# EasyEDA Pro project MAINBOARD.epro

# Schematic Schematic1
Board Name: Board1; Create Date: 2024-12-09; Page Name: P1; Project Name: 圈圈机分电板结构; Schematic Name: Schematic1; Update Date: 2025-01-17; Company: WAKKK; Drawed: WAKKK; Page Size: A4; Version: V1.0
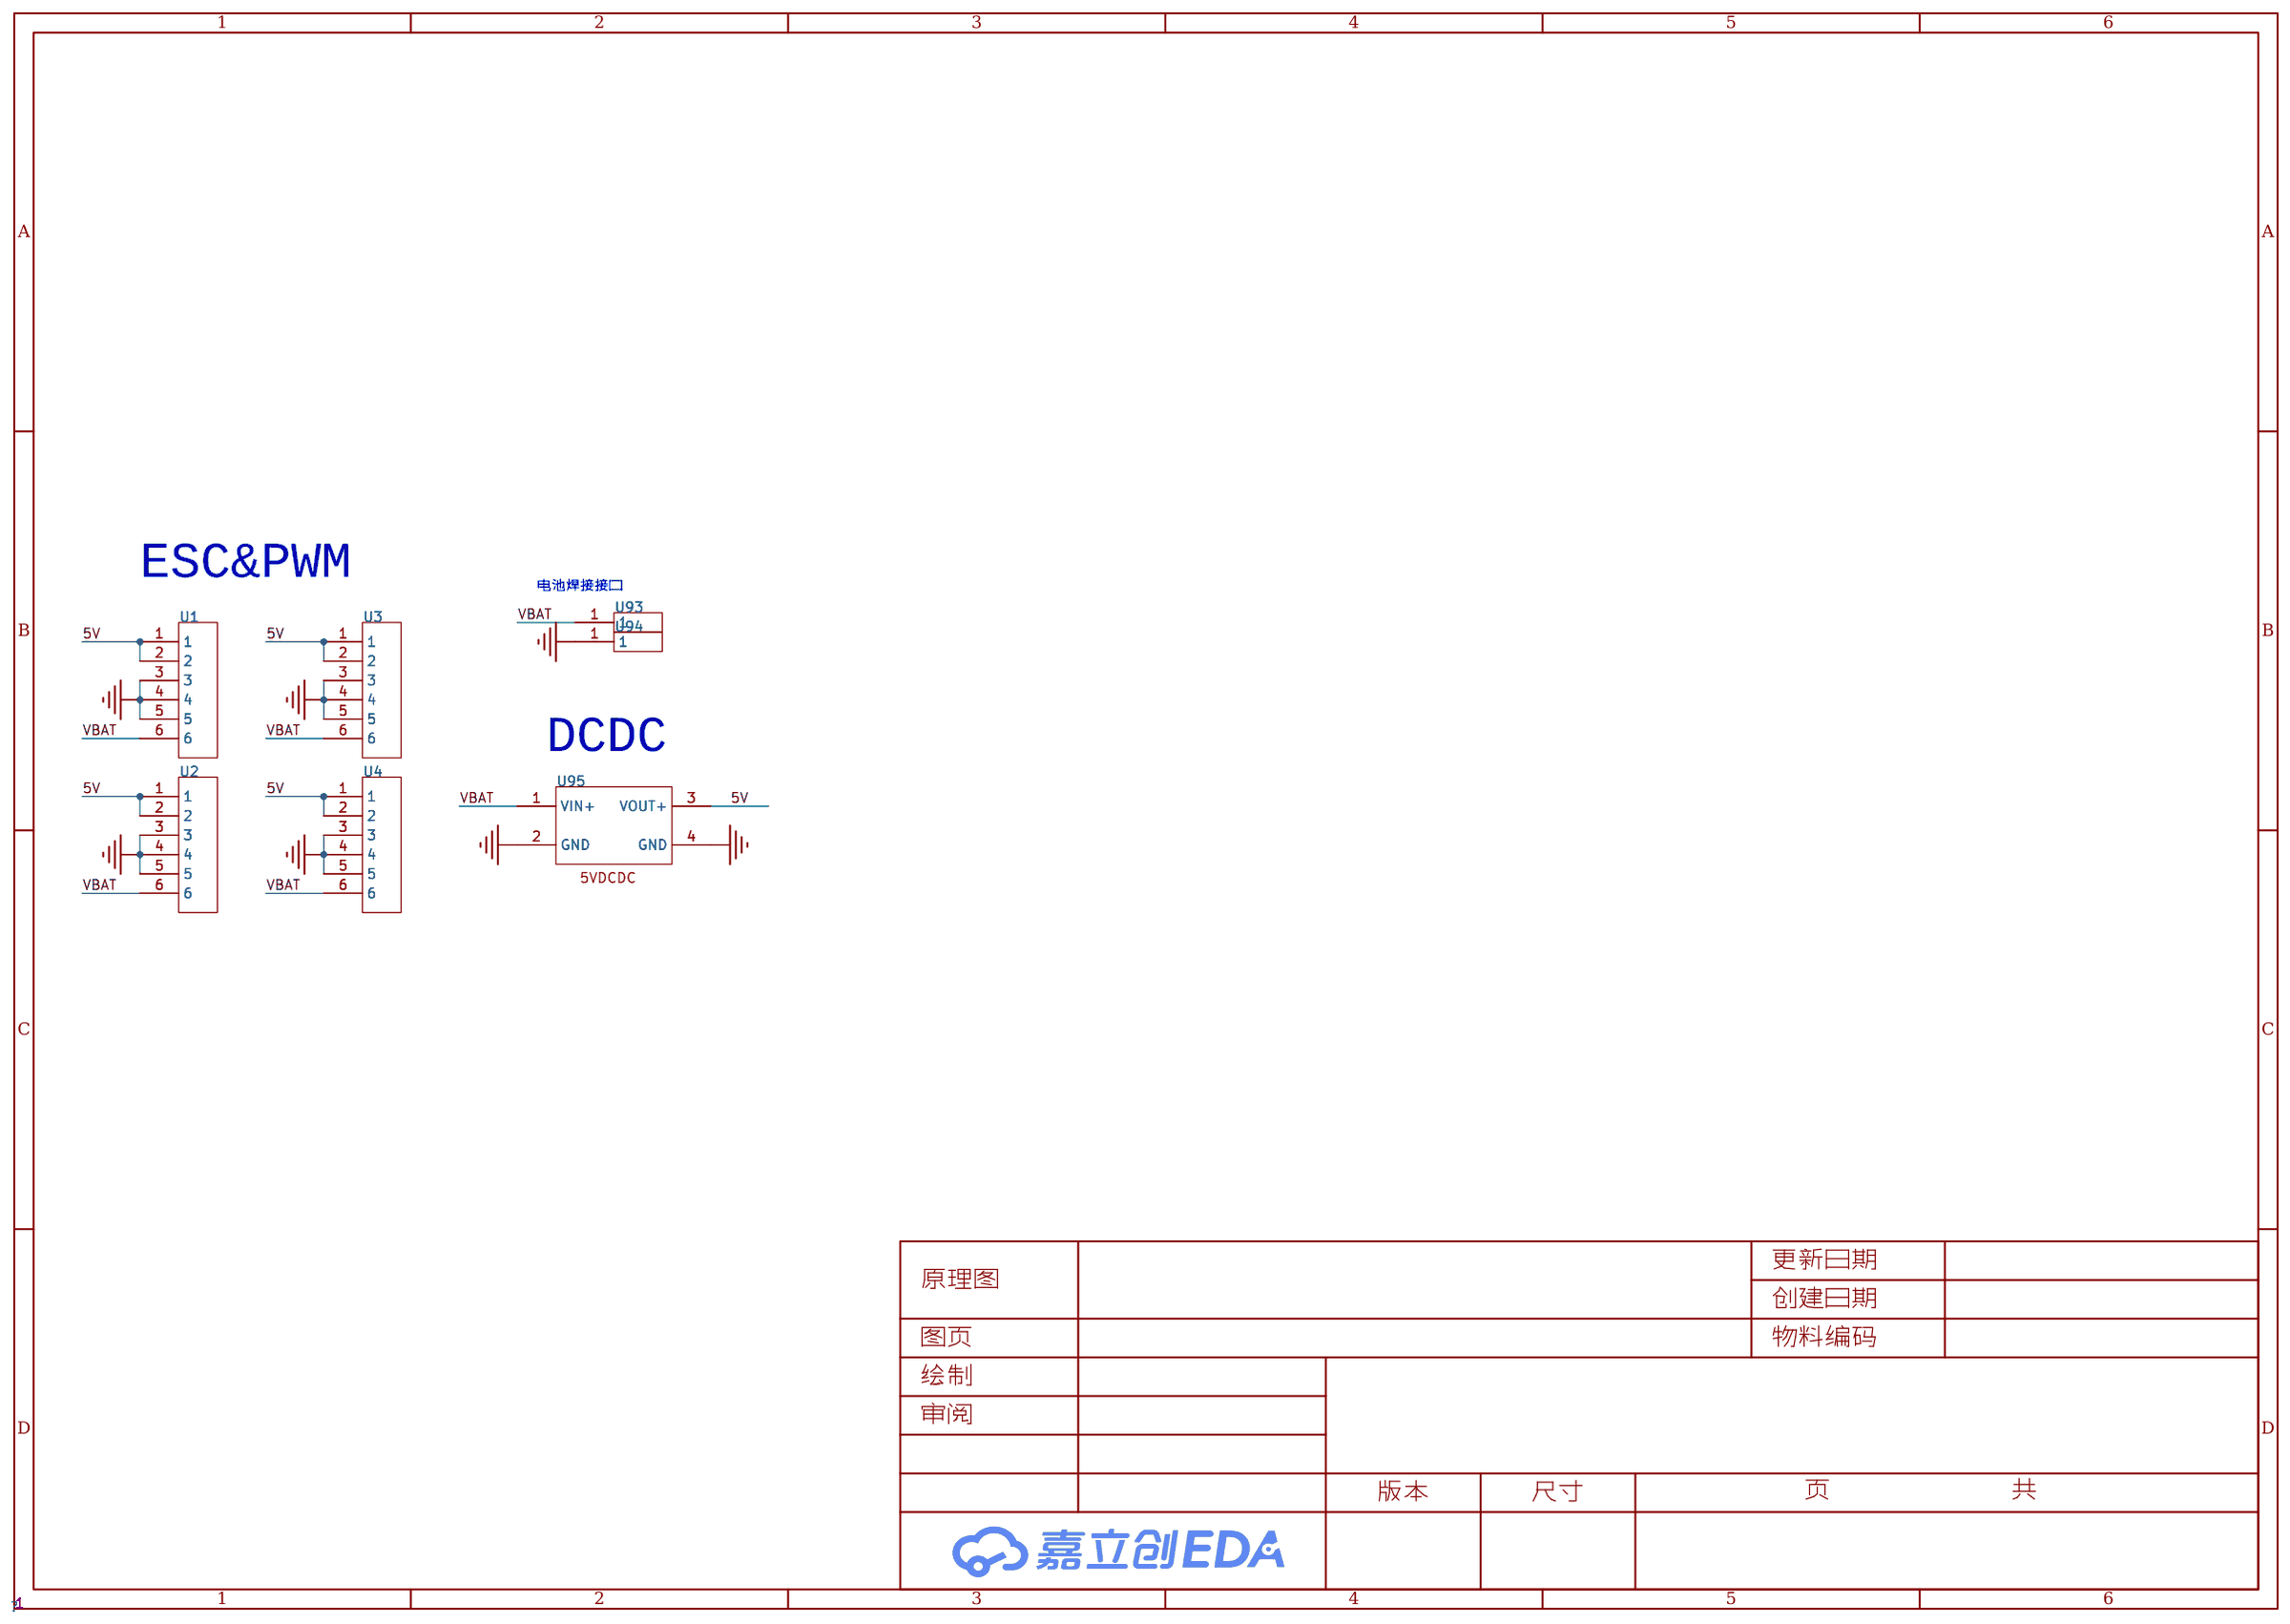
[diagram p0: schematic sheet]

## Parts
U1  -  [6pin焊接引出]
U2  -  [6pin焊接引出]
U3  -  [6pin焊接引出]
U4  -  [6pin焊接引出]
U93  -  [表面焊盘]
U94  -  [表面焊盘]
U95  -  [DCDC5V不带直插排针焊盘]

## Library data of the parts
U1-U4 = 6pin焊接引出: Check: false
U93 U94 = 表面焊盘: Check: false
U95 = DCDC-5V: 蓝色DCDC降压模块（贴片）; Check: false

## Nets
5V: U1.1 U1.2 U2.1 U2.2 U3.1 U3.2 U4.1 U4.2 U95.3(VOUT+)
GND: U1.3 U1.4 U1.5 U2.3 U2.4 U2.5 U3.3 U3.4 U3.5 U4.3 U4.4 U4.5 U94.1 U95.2(GND) U95.4(GND)
VBAT: U1.6 U2.6 U3.6 U4.6 U93.1 U95.1(VIN+)

## Notes on the sheet
- ESC&PWM
- 电池焊接接口
- DCDC

# Board PCB1
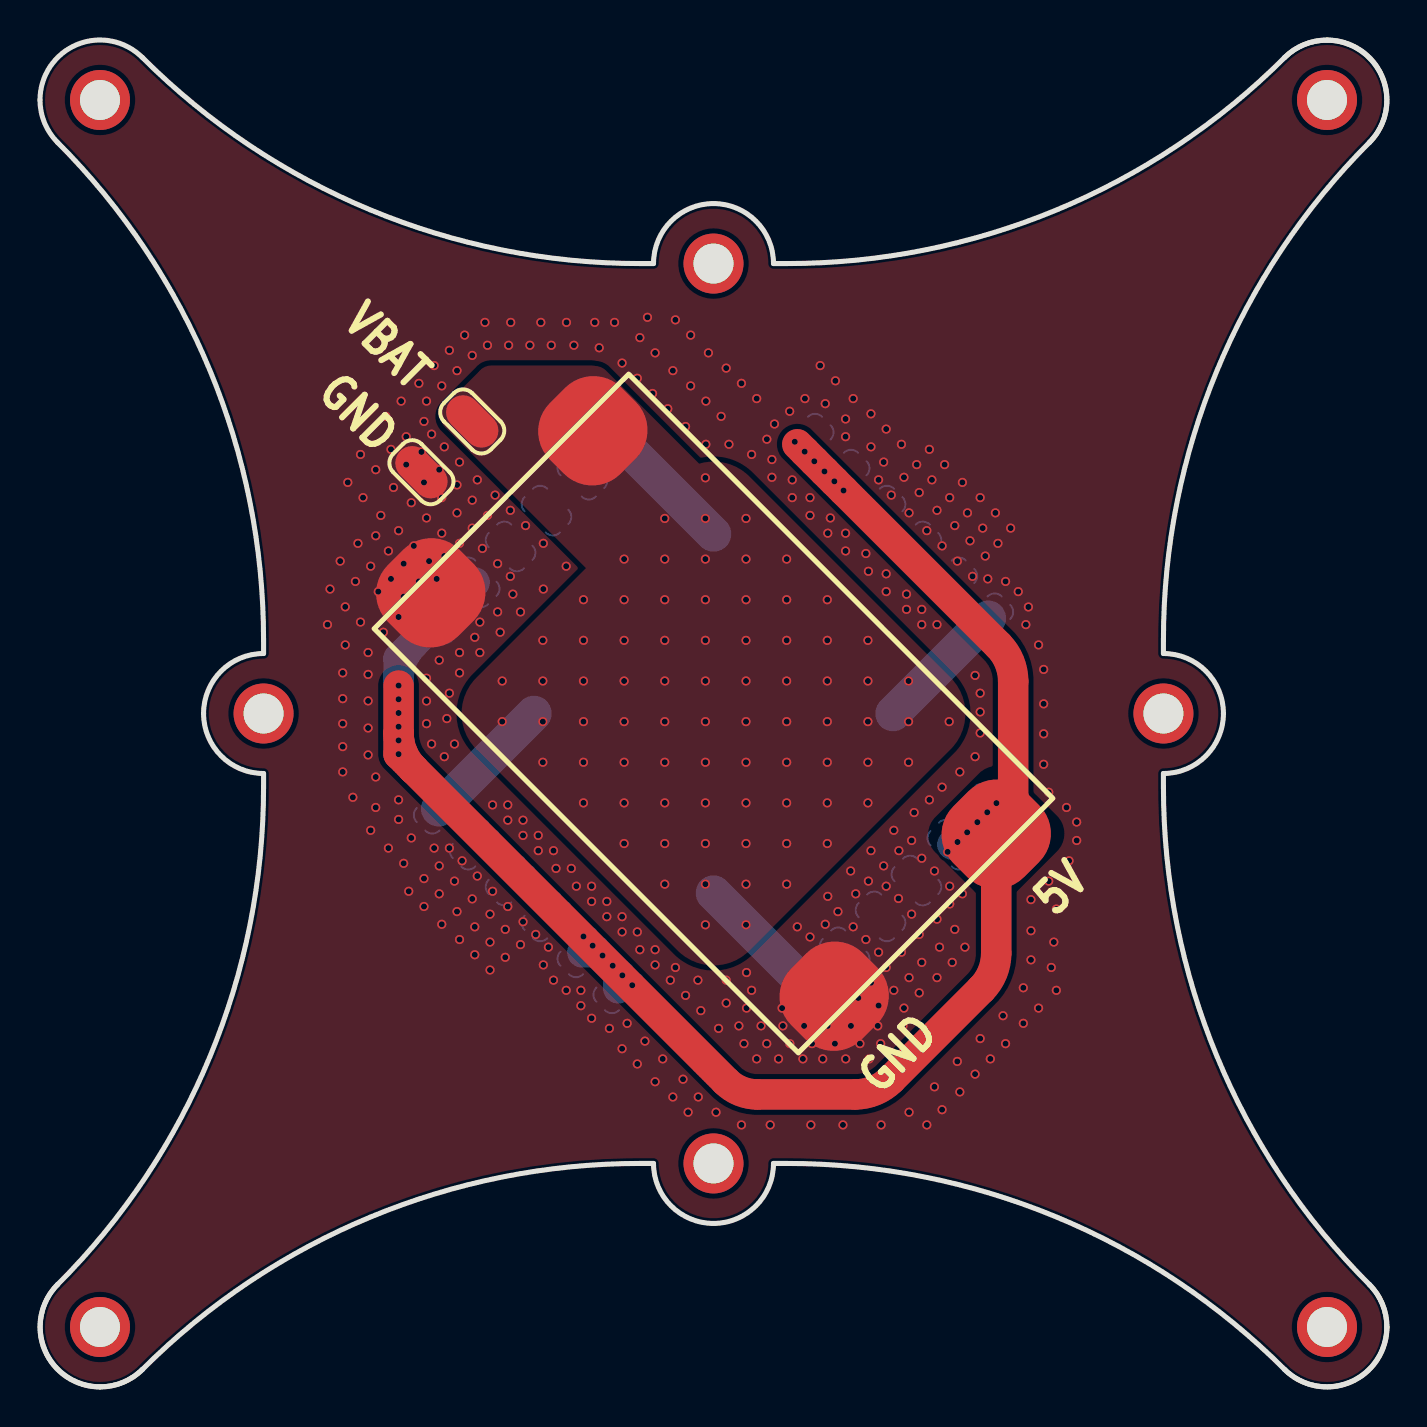
[diagram p1: board, top side]
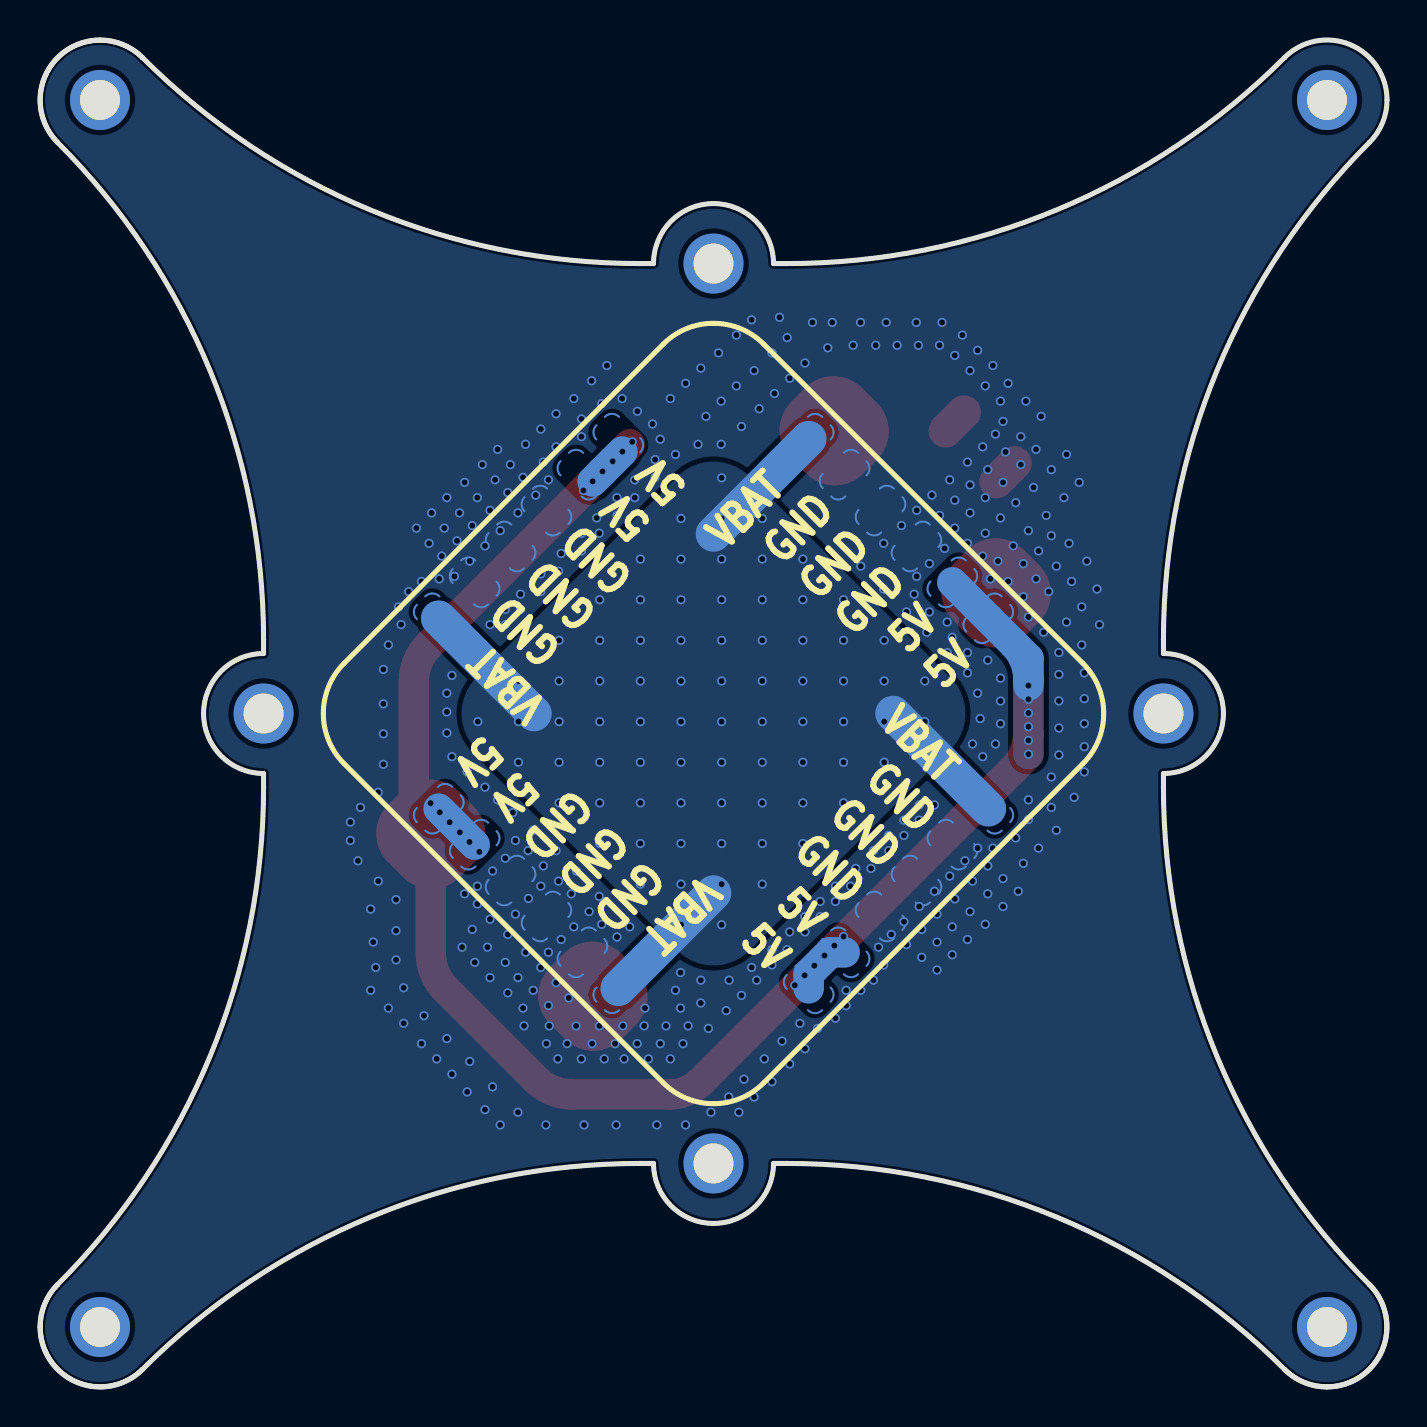
[diagram p2: board, bottom side, seen from below]

Outline 67.36 x 67.36 mm; copper layers: Top Layer, Bottom Layer. Coordinates in mm from the lower left corner of the outline.
Outline path: 0.88,5.12 arc(0.23,1.85) 3,0 arc(4.15,0.23) 5.12,0.88 ; 0.88,5.12 arc(0.88,0.88) 5.12,0.88 ; 0.88,5.12 arc(8.5,16.53) 11.18,29.99 11.18,30.68 arc(9.06,31.56) 8.18,33.68 arc(9.06,35.8) 11.18,36.68 11.18,37.37 arc(8.5,50.83) 0.88,62.24 arc(0.23,63.21) 0,64.36 arc(1.85,67.13) 5.12,66.48 arc(16.53,58.86) 29.99,56.18 30.68,56.18 arc(33.68,59.18) 36.68,56.18 37.37,56.18 arc(50.83,58.86) 62.24,66.48 ; 5.12,0.88 arc(16.53,8.5) 29.99,11.18 30.68,11.18 arc(33.68,8.18) 36.68,11.18 37.37,11.18 arc(50.83,8.5) 62.24,0.88 ; 62.24,0.88 arc(66.48,0.88) 66.48,5.12 ; 62.24,0.88 arc(65.51,0.23) 67.36,3 arc(67.13,4.15) 66.48,5.12 ; 66.48,62.24 arc(58.86,50.83) 56.18,37.37 56.18,36.68 arc(58.3,35.8) 59.18,33.68 arc(58.3,31.56) 56.18,30.68 56.18,29.99 arc(58.86,16.53) 66.48,5.12 ; 66.48,62.24 arc(66.48,66.48) 62.24,66.48 ; 66.48,62.24 arc(67.13,65.51) 64.36,67.36 arc(63.21,67.13) 62.24,66.48
Stack: Top Layer 0.035mm / Dielectric1 1.51mm FR4 er 4.5 / Bottom Layer 0.035mm

## Design rules (mm)
template: 自定义配置
spacing copperThickness1oz (default): track to track 0.102, other pairs 0.152 to 0.3
spacing copperThickness2oz: track to track 0.203, other pairs 0.152 to 0.3
track width copperThickness1oz (default): min 0.127, default 0.254, max 2.54
track width copperThickness2oz: min 0.203, default 0.254, max 2.54
differential pair differentialPair (default): width min 0.127, default 0.254, max 2.54; gap min 0.152, default 0.152
via viaSize (default): diameter min 0.254, default 0.457, max 10; hole min 0.3, default 0.305, max 6.299

## Placement (name value [footprint] x y rotation side)
NOREF  -  [Pad_e9]  33.68 56.18 0 top
NOREF#2  -  [Pad_e13]  33.68 11.18 0 top
NOREF#3  -  [Pad_e12]  11.18 33.68 0 top
NOREF#4  -  [Pad_e14]  3 64.36 0 top
NOREF#5  -  [Pad_e17]  3 3 0 top
NOREF#6  -  [Pad_e11]  56.18 33.68 0 top
NOREF#7  -  [Pad_e16]  64.36 3 0 top
NOREF#8  -  [Pad_e15]  64.36 64.36 0 top
U1  -  [6pin焊接引出]  24.43 42.93 135 bottom
U2  -  [6pin焊接引出]  24.43 24.43 225 bottom
U3  -  [6pin焊接引出]  42.93 24.43 315 bottom
U4  -  [6pin焊接引出]  42.93 42.93 45 bottom
U93  -  [表面焊盘]  21.62 48.29 315 top
U94  -  [表面焊盘]  19.08 45.75 315 top
U95  -  [DCDC5V不带直插排针焊盘]  33.68 33.68 315 top

## Footprints (pads in the part's own frame, mm; a bottom-side part is the same pattern mirrored in y, then rotated)
6pin焊接引出
  custom 2.5x1.6 smd: 1(0,-6.35) 2(0,-3.81) 3(0,-1.27) 4(0,1.27) 5(0,3.81) 6(0,6.35)
DCDC5V不带直插排针焊盘
  rrect 5x5.08 smd: 1(-14.264,5.73) 2(-14.264,-5.73) 3(14.264,5.73) 4(14.264,-5.73)
Pad_e9
  round 3 hole 2: 1(0,0)
Pad_e11
  round 3 hole 2: 1(0,0)
Pad_e12
  round 3 hole 2: 1(0,0)
Pad_e13
  round 3 hole 2: 1(0,0)
Pad_e14
  round 3 hole 2: 1(0,0)
Pad_e15
  round 3 hole 2: 1(0,0)
Pad_e16
  round 3 hole 2: 1(0,0)
Pad_e17
  round 3 hole 2: 1(0,0)
表面焊盘
  rrect 3x1.7 smd: 1(0,0)

## Nets
As in the schematic.

Pads without a net: NOREF 1; NOREF#2 1; NOREF#3 1; NOREF#4 1; NOREF#5 1; NOREF#6 1; NOREF#7 1; NOREF#8 1

## Via types
v1: diameter 0.457, hole 0.305, Top Layer to Bottom Layer, 491 vias

## Routing (per net, layer and track width the routed paths; a pad name or vN(x,y) marks a point on that pad's centre or on a via; arc(x,y) is an arc through that point)
5V: length 92
  Top Layer w1.524: 17.93,32.7 v1(17.93,31.65) 18.68,30.9 ; 17.93,32.7 v1(17.93,35.08) ; 17.93,32.7 arc(17.94,32.52) 17.96,32.34 arc(18.02,32.03) 18.13,31.73 arc(18.36,31.29) 18.68,30.9 ; 37.87,47.14 v1(38.24,46.78) v1(38.72,46.29) v1(39.23,45.78) v1(39.72,45.29) v1(40.18,44.83) 47.92,37.09 arc(48.47,36.27) 48.67,35.3 48.67,29.55 arc(48.47,28.57) 47.92,27.75 U95.3 47.82,21.69 arc(47.62,20.72) 47.07,19.9 42.55,15.37 arc(41.73,14.82) 40.76,14.63 35.88,14.63 arc(35.02,14.8) 34.3,15.28 18.68,30.9
  Bottom Layer w1.524: U3.2 U3.1 ; v1(38.24,46.78) v1(38.72,46.29) v1(39.23,45.78) v1(39.72,45.29) ; v1(17.93,35.08) 17.93,35.38 ; 17.93,35.38 17.93,36.43 18.68,37.18 ; 17.93,35.38 arc(18.13,36.35) 18.68,37.18 ; U2.1 28.92,20.66 27.85,21.74 U2.2 ; 18.68,37.18 U1.1 U1.2
  vias: v1(17.93,34.39) v1(17.93,33.71) v1(17.93,33.02) v1(17.93,32.33) v1(27.18,22.53) v1(27.64,22.07) v1(28.13,21.58) v1(28.64,21.07) v1(29.12,20.58) v1(29.62,20.09) v1(37.74,47.27) v1(45.39,26.76) v1(45.88,27.25) v1(46.37,27.74) v1(46.87,28.25) v1(47.37,28.74) v1(47.83,29.2)
GND:
  vias: v1(14.38,38.12) v1(14.5,39.9) v1(15.01,41.3) v1(15.14,35.71) v1(15.14,34.42) v1(15.14,33.17) v1(15.14,32.02) v1(15.14,30.76) v1(15.27,39.01) v1(15.27,37.11) v1(15.39,45.24) v1(15.65,29.49) v1(15.77,40.28) v1(15.9,42.19) v1(16.03,46.63) v1(16.03,38.25) v1(16.15,44.48) v1(16.41,36.73) v1(16.41,35.63) v1(16.41,34.31) v1(16.41,32.96) v1(16.41,31.61) v1(16.53,41.05) v1(16.53,27.84) v1(16.79,45.87) v1(16.79,42.57) v1(16.79,30.51) v1(16.79,28.98) v1(16.92,39.78) v1(17.04,43.59) v1(17.17,37.74) v1(17.3,48.54) v1(17.42,41.81) v1(17.42,26.95) v1(17.55,46.89) v1(17.55,40.41) v1(17.68,44.98) v1(17.93,42.82) v1(17.93,38.51) v1(17.93,29.36) v1(17.93,28.38) v1(18.06,49.3) v1(18.19,41.17) v1(18.19,39.52) v1(18.19,26.19) v1(18.31,47.52) v1(18.31,46.13) v1(18.44,24.79) v1(18.57,44.22) v1(18.57,27.46) v1(18.69,42.06) v1(18.95,50.19) v1(18.95,40.28) v1(19.08,46.76) v1(19.2,48.29) v1(19.2,45.24) v1(19.2,25.43) v1(19.2,24.03) v1(19.33,49.3) v1(19.33,43.46) v1(19.33,35.45) v1(19.33,34.3) v1(19.33,33.17) v1(19.46,41.3) v1(19.58,47.65) v1(19.58,32.16) v1(19.71,51.08) v1(19.71,26.95) v1(19.84,40.41) v1(19.96,45.87) v1(19.96,36.35) v1(19.96,26.06) v1(19.96,24.66) v1(20.09,50.06) v1(20.09,44.48) v1(20.09,42.7) v1(20.09,23.14) v1(20.22,47.02) v1(20.22,41.55) v1(20.22,31.52) v1(20.34,33.43) v1(20.47,51.84) v1(20.47,34.7) v1(20.47,26.95) v1(20.73,32.16) v1(20.73,25.3) v1(20.85,50.83) v1(20.85,45.11) v1(20.85,43.71) v1(20.85,23.77) v1(20.98,46.25) v1(20.98,42.19) v1(20.98,36.73) v1(20.98,35.71) v1(20.98,22.38) v1(21.11,26.31) v1(21.23,52.6) v1(21.62,51.59) v1(21.62,44.35) v1(21.62,42.95) v1(21.62,24.41) v1(21.74,37.49) v1(21.74,23.01) v1(21.74,21.62) v1(21.87,45.36) v1(21.87,25.55) v1(22,38.25) v1(22,36.73) v1(22.12,41.94) v1(22.25,53.24) v1(22.38,52.1) v1(22.38,43.59) v1(22.5,23.65) v1(22.5,22.25) v1(22.5,20.85) v1(22.63,29.11) v1(22.63,24.79) v1(22.76,44.6) v1(22.89,41.17) v1(22.89,38.76) v1(23.01,37.74) v1(23.27,22.89) v1(23.27,21.49) v1(23.39,29.11) v1(23.39,28.35) v1(23.39,24.03) v1(23.44,52.1) v1(23.52,43.84) v1(23.52,40.54) v1(23.54,53.24) v1(23.65,39.65) v1(24.03,38.76) v1(24.03,22.12) v1(24.16,28.35) v1(24.16,27.58) v1(24.16,23.27) v1(24.28,43.08) v1(24.5,52.1) v1(24.79,22.63) v1(24.92,27.58) v1(24.92,26.82) v1(25.04,53.24) v1(25.17,42.19) v1(25.17,39.9) v1(25.17,21.11) v1(25.43,22) v1(25.57,52.1) v1(25.68,26.82) v1(25.68,20.35) v1(25.81,25.93) v1(26.33,53.24) v1(26.31,41.05) v1(26.31,19.84) v1(26.57,25.93) v1(26.7,52.1) v1(26.82,25.04) v1(27.05,19.84) v1(27.05,19.07) v1(27.58,25.04) v1(27.58,24.28) v1(27.58,18.44) v1(27.74,53.24) v1(27.97,51.97) v1(28.35,24.28) v1(28.35,23.52) v1(28.47,17.93) v1(28.73,53.24) v1(29.11,51.21) v1(29.11,23.52) v1(29.11,22.76) v1(29.11,16.92) v1(29.36,18.19) v1(29.87,50.44) v1(29.87,22.76) v1(29.87,16.15) v1(30,52.48) v1(30,21.87) v1(30.25,17.3) v1(30.38,53.49) v1(30.63,49.68) v1(30.76,51.71) v1(30.76,21.87) v1(30.76,21.11) v1(30.76,15.27) v1(31.14,16.41) v1(31.39,48.92) v1(31.52,20.35) v1(31.65,50.83) v1(31.65,14.5) v1(31.78,53.37) v1(31.78,20.98) v1(32.16,15.39) v1(32.28,48.03) v1(32.28,19.58) v1(32.41,13.74) v1(32.54,52.6) v1(32.54,50.06) v1(32.9,20.35) v1(32.92,14.5) v1(33.05,18.82) v1(33.3,49.3) v1(33.3,47.14) v1(33.43,51.71) v1(33.81,13.74) v1(33.93,17.93) v1(34.06,48.54) v1(34.31,50.95) v1(34.31,20.35) v1(34.31,19.2) v1(34.45,47.14) v1(34.95,18.06) v1(35.08,50.19) v1(35.08,13.11) v1(35.2,17.17) v1(35.33,20.73) v1(35.33,18.95) v1(35.59,46.63) v1(35.59,19.84) v1(35.84,49.43) v1(35.84,16.41) v1(36.06,18.06) v1(36.35,47.4) v1(36.34,17.17) v1(36.52,13.11) v1(36.6,46.38) v1(36.6,45.49) v1(36.73,48.16) v1(36.93,16.41) v1(37.11,18.95) v1(37.15,18.06) v1(37.49,48.79) v1(37.5,17.17) v1(37.62,45.36) v1(37.62,44.48) v1(37.87,23.01) v1(38.21,18.06) v1(38.15,16.41) v1(38.25,49.43) v1(38.51,44.48) v1(38.51,43.59) v1(38.51,22.5) v1(38.6,17.17) v1(38.55,13.11) v1(39.01,51.08) v1(39.14,16.41) v1(39.27,49.17) v1(39.27,23.14) v1(39.4,42.7) v1(39.4,24.54) v1(39.39,18.06) v1(39.52,43.46) v1(39.78,50.32) v1(39.75,17.17) v1(39.9,23.77) v1(40.15,13.11) v1(40.28,48.41) v1(40.28,47.52) v1(40.28,42.7) v1(40.28,41.81) v1(40.29,16.41) v1(40.54,25.81) v1(40.55,18.06) v1(40.67,49.43) v1(40.67,23.01) v1(40.79,24.66) v1(40.92,19.46) v1(41,17.17) v1(41.3,41.68) v1(41.3,22.38) v1(41.43,40.79) v1(41.43,25.3) v1(41.46,16.41) v1(41.55,48.67) v1(41.55,47.02) v1(41.55,26.82) v1(41.55,20.22) v1(41.89,18.06) v1(41.94,45.36) v1(41.94,21.74) v1(41.94,19.08) v1(42.04,17.17) v1(42.06,13.11) v1(42.19,46.25) v1(42.19,26.06) v1(42.32,47.9) v1(42.32,40.67) v1(42.32,39.78) v1(42.32,25.04) v1(42.32,20.98) v1(42.57,44.6) v1(42.7,27.84) v1(42.7,19.84) v1(42.95,26.82) v1(42.93,24.43) v1(43.08,47.14) v1(43.08,21.74) v1(43.21,45.49) v1(43.21,18.95) v1(43.16,18.06) v1(43.33,39.65) v1(43.33,38.89) v1(43.46,43.71) v1(43.46,20.47) v1(43.46,13.74) v1(43.59,27.33) v1(43.59,23.65) v1(43.71,28.73) v1(43.84,46.13) v1(43.97,44.73) v1(43.97,22.63) v1(43.97,19.71) v1(44.09,38.89) v1(44.09,38.12) v1(44.09,26.44) v1(44.09,21.23) v1(44.35,42.82) v1(44.35,13.11) v1(44.47,46.89) v1(44.47,29.36) v1(44.6,45.36) v1(44.73,25.81) v1(44.73,15.01) v1(44.86,43.84) v1(44.86,38.12) v1(44.86,23.39) v1(44.86,20.47) v1(44.98,22) v1(45.11,42.06) v1(45.11,30) v1(45.11,13.87) v1(45.24,46.13) v1(45.49,44.48) v1(45.49,25.04) v1(45.49,24.16) v1(45.62,21.23) v1(45.75,43.08) v1(45.75,22.89) v1(45.87,41.3) v1(45.87,16.28) v1(46,30.76) v1(46,14.76) v1(46.13,45.24) v1(46.13,24.66) v1(46.25,22) v1(46.38,43.71) v1(46.51,42.32) v1(46.63,40.54) v1(46.76,35.59) v1(46.76,31.52) v1(46.76,15.65) v1(47.02,44.48) v1(47.02,34.7) v1(47.02,33.76) v1(47.02,32.71) v1(47.02,17.42) v1(47.14,42.95) v1(47.27,41.55) v1(47.4,40.41) v1(47.52,16.41) v1(47.78,43.71) v1(47.9,42.19) v1(48.16,18.57) v1(48.28,40.28) v1(48.28,17.17) v1(48.54,42.95) v1(48.92,39.78) v1(49.17,19.96) v1(49.17,18.19) v1(49.3,38.12) v1(49.43,39.01) v1(49.56,24.37) v1(49.56,22.82) v1(49.56,21.36) v1(49.94,37.11) v1(49.94,18.95) v1(50.19,35.89) v1(50.19,34.16) v1(50.19,32.66) v1(50.19,31.14) v1(50.44,29.74) v1(50.44,25.3) v1(50.57,20.98) v1(50.7,22.25) v1(50.83,23.9) v1(50.83,19.84) v1(51.33,28.98) v1(51.46,26.31) v1(51.84,28.25) v1(51.84,27.33)
VBAT: length 26.9
  Bottom Layer w1.778: 33.68,42.66 U1.6 ; U2.6 24.7,33.68 ; U4.6 42.66,33.68 ; U3.6 33.68,24.7
  vias: v1(23.11,35.31) v1(23.11,33.27) v1(25.15,37.34) v1(25.15,35.31) v1(25.15,33.27) v1(25.15,31.24) v1(27.18,39.37) v1(27.18,37.34) v1(27.18,35.31) v1(27.18,33.27) v1(27.18,31.24) v1(27.18,29.21) v1(29.21,41.4) v1(29.21,39.37) v1(29.21,37.34) v1(29.21,35.31) v1(29.21,33.27) v1(29.21,31.24) v1(29.21,29.21) v1(29.21,27.18) v1(31.24,43.43) v1(31.24,41.4) v1(31.24,39.37) v1(31.24,37.34) v1(31.24,35.31) v1(31.24,33.27) v1(31.24,31.24) v1(31.24,29.21) v1(31.24,27.18) v1(31.24,25.15) v1(33.27,45.47) v1(33.27,43.43) v1(33.27,41.4) v1(33.27,39.37) v1(33.27,37.34) v1(33.27,35.31) v1(33.27,33.27) v1(33.27,31.24) v1(33.27,29.21) v1(33.27,27.18) v1(33.27,25.15) v1(33.27,23.11) v1(35.31,43.43) v1(35.31,41.4) v1(35.31,39.37) v1(35.31,37.34) v1(35.31,35.31) v1(35.31,33.27) v1(35.31,31.24) v1(35.31,29.21) v1(35.31,27.18) v1(35.31,25.15) v1(35.31,23.11) v1(37.34,41.4) v1(37.34,39.37) v1(37.34,37.34) v1(37.34,35.31) v1(37.34,33.27) v1(37.34,31.24) v1(37.34,29.21) v1(37.34,27.18) v1(37.34,25.15) v1(39.37,39.37) v1(39.37,37.34) v1(39.37,35.31) v1(39.37,33.27) v1(39.37,31.24) v1(39.37,29.21) v1(39.37,27.18) v1(41.4,37.34) v1(41.4,35.31) v1(41.4,33.27) v1(41.4,31.24) v1(41.4,29.21) v1(43.43,35.31) v1(43.43,33.27) v1(43.43,31.24) v1(45.47,33.27)

## Copper pours and planes (outline as drawn; the poured copper is in the pictures)
5V on Bottom Layer: 17.17,35.84 18.69,35.84 18.69,30.89 17.17,30.89
GND on Top Layer: -7.09,73.43 76.61,73.43 76.61,-3.4 -7.09,-3.4
GND on Bottom Layer: -10.13,74.83 78.64,74.83 78.64,-5.18 -10.13,-5.18
VBAT on Top Layer: 20.03,51.01 34.09,51.01 34.09,36.95 20.03,36.95
VBAT on Top Layer: 25.29,51.05 36.81,51.05 36.81,39.53 25.29,39.53
VBAT on Top Layer: 21.81,51.09 28.35,51.09 28.35,46.63 21.81,46.63
VBAT on Top Layer: 21.83,31.88 21.67,32.06 21.48,32.32 21.32,32.6 21.21,32.9 21.13,33.2 21.09,33.52 21.09,33.84 21.13,34.16 21.21,34.46 21.32,34.76 21.48,35.04 21.67,35.3 21.83,35.48 31.88,45.53 32.06,45.69 32.32,45.88 32.6,46.04 32.9,46.15 33.2,46.23 33.52,46.27 33.84,46.27 34.16,46.23 34.46,46.15 34.76,46.04 35.04,45.88 35.3,45.69 35.48,45.53 45.53,35.48 45.69,35.3 45.88,35.04 46.04,34.76 46.15,34.46 46.23,34.16 46.27,33.84 46.27,33.52 46.23,33.2 46.15,32.9 46.04,32.6 45.88,32.32 45.69,32.06 45.53,31.88 35.48,21.83 35.3,21.67 35.04,21.48 34.76,21.32 34.46,21.21 34.16,21.13 33.84,21.09 33.52,21.09 33.2,21.13 32.9,21.21 32.6,21.32 32.32,21.48 32.06,21.67 31.88,21.83
VBAT on Bottom Layer: 21.83,31.88 21.67,32.06 21.48,32.32 21.32,32.6 21.21,32.9 21.13,33.2 21.09,33.52 21.09,33.84 21.13,34.16 21.21,34.46 21.32,34.76 21.48,35.04 21.67,35.3 21.83,35.48 31.88,45.53 32.06,45.69 32.32,45.88 32.6,46.04 32.9,46.15 33.2,46.23 33.52,46.27 33.84,46.27 34.16,46.23 34.46,46.15 34.76,46.04 35.04,45.88 35.3,45.69 35.48,45.53 45.53,35.48 45.69,35.3 45.88,35.04 46.04,34.76 46.15,34.46 46.23,34.16 46.27,33.84 46.27,33.52 46.23,33.2 46.15,32.9 46.04,32.6 45.88,32.32 45.69,32.06 45.53,31.88 35.48,21.83 35.3,21.67 35.04,21.48 34.76,21.32 34.46,21.21 34.16,21.13 33.84,21.09 33.52,21.09 33.2,21.13 32.9,21.21 32.6,21.32 32.32,21.48 32.06,21.67 31.88,21.83

## Text on the board
Bottom Silkscreen Layer: 5V | GND | VBAT
Document Layer: 2 | 3 | 1 | 4
Top Silkscreen Layer: GND | VBAT | 5V
